# Altium schematic sheet TOP.SchDoc: Q24 VCU
size A3; Author: JChisholm; DrawnBy: JChisholm; Organization: Queen's Formula SAE; Address1: 130 Stuart St, Kingston; Address2: Ontario; Address3: Canada; Address4: K7L 2V9; DocumentNumber: 1; Revision: 0; SheetNumber: 1; SheetTotal: 16
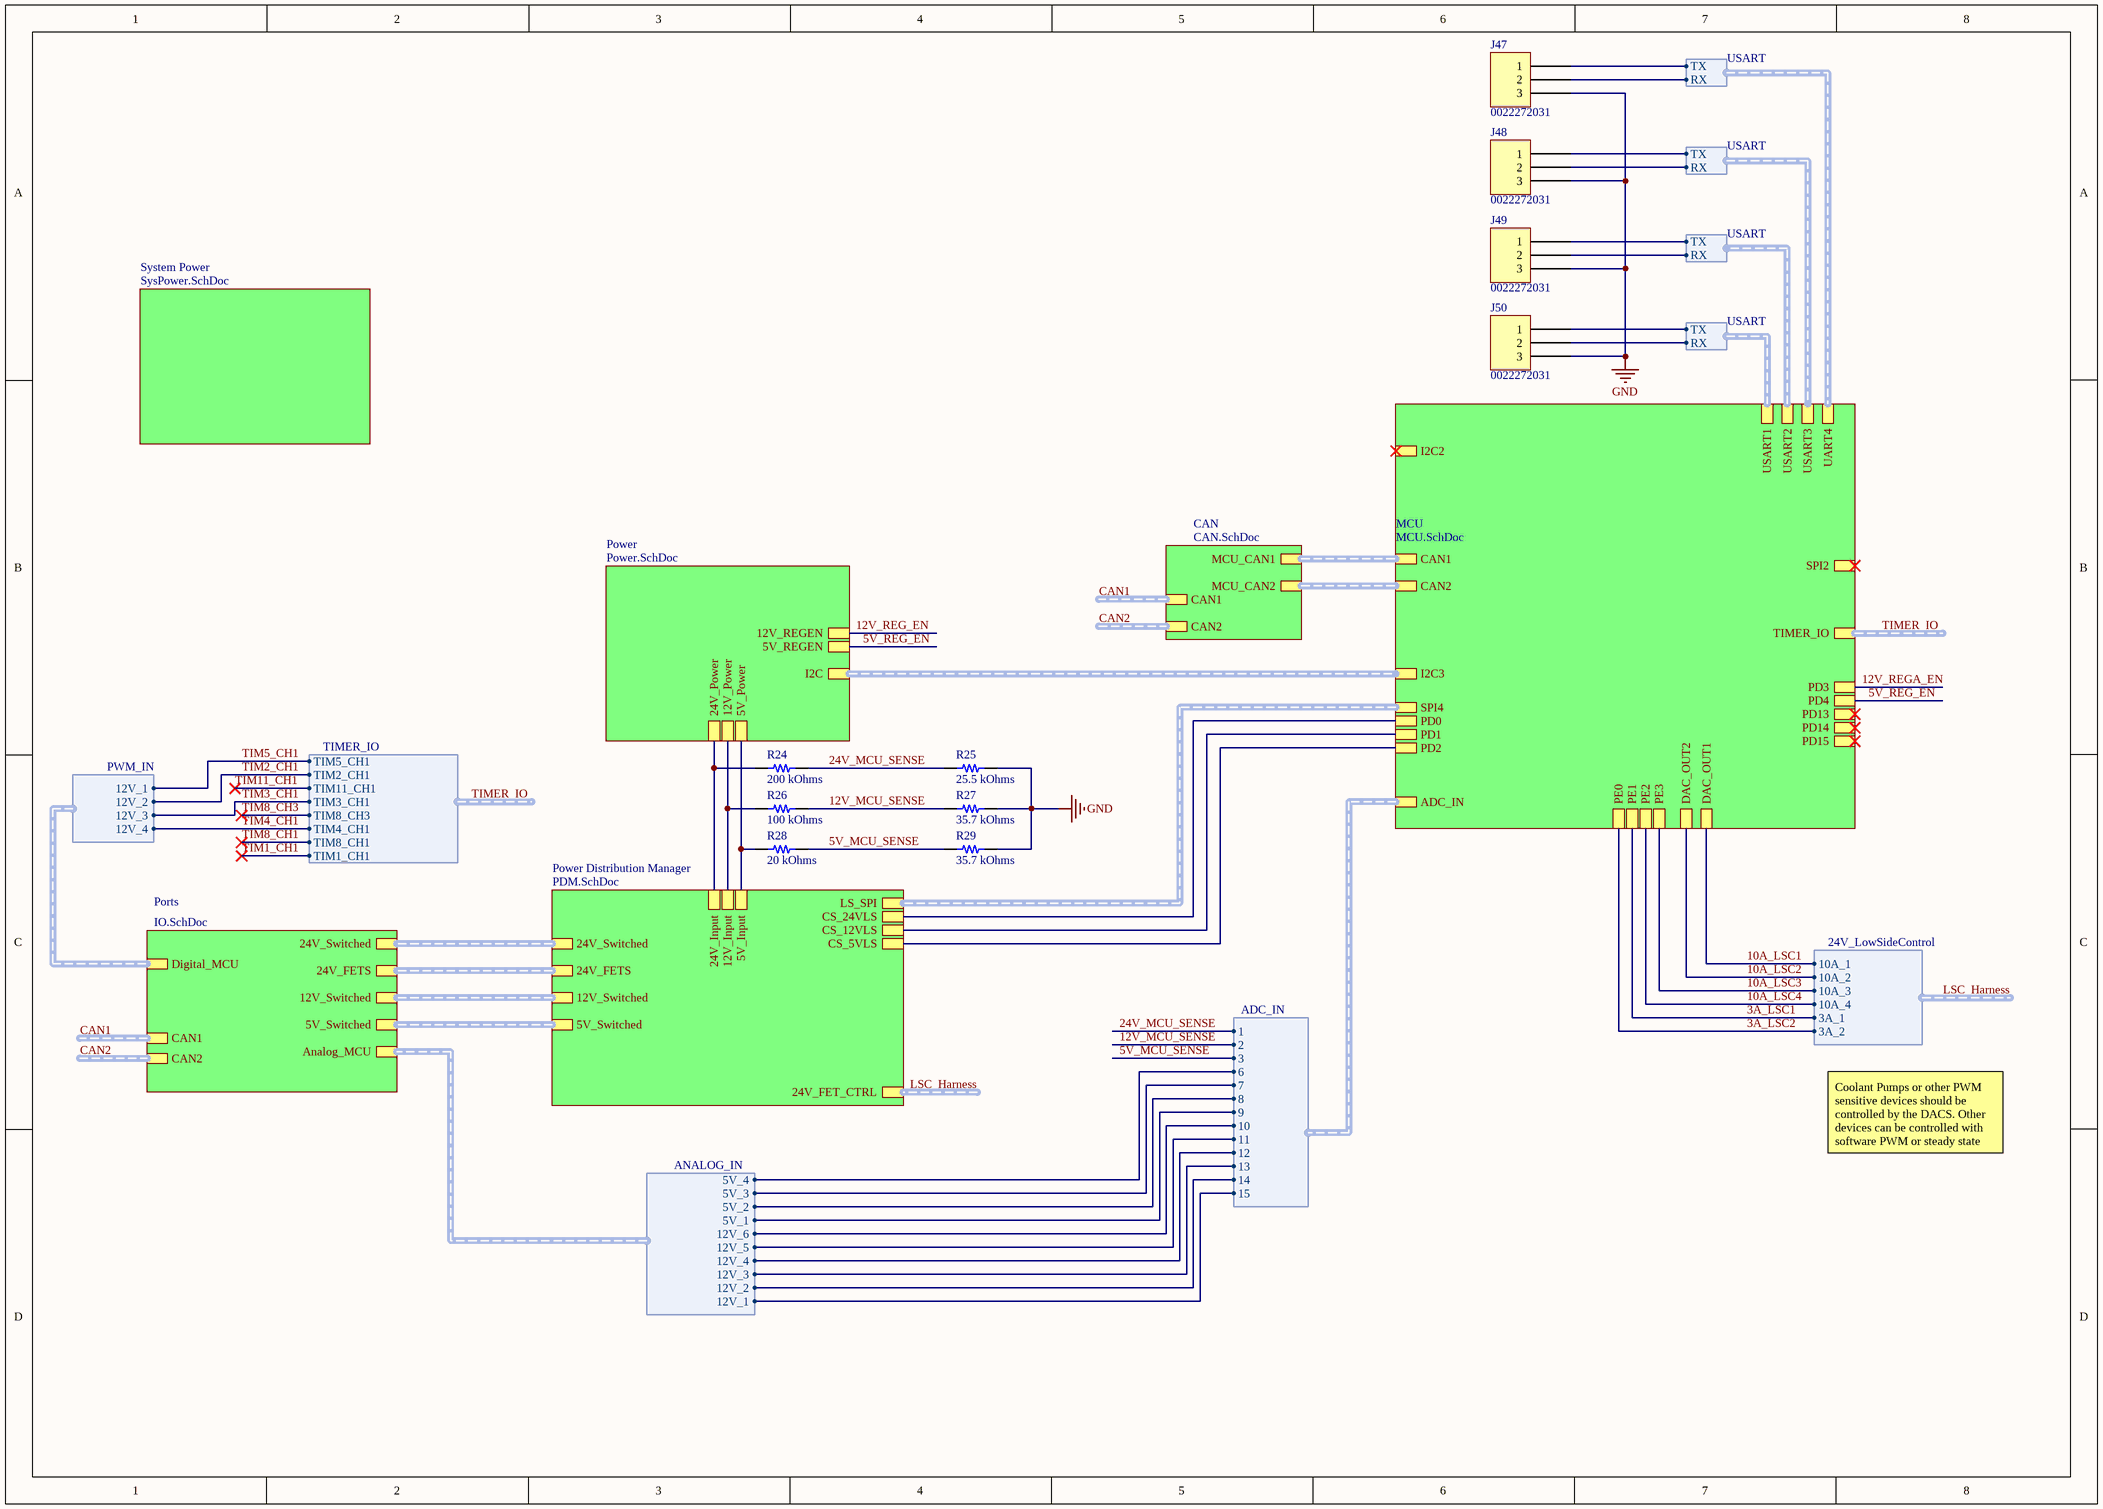
[diagram p0: TOP.SchDoc]

## Parts
J47  0022272031  [MOLEX KK 0022272031]
J48  0022272031  [MOLEX KK 0022272031]
J49  0022272031  [MOLEX KK 0022272031]
J50  0022272031  [MOLEX KK 0022272031]
R24  200 kOhms  [RES 0603_1608]
R25  25.5 kOhms  [RES 0603_1608]
R26  100 kOhms  [RES 0603_1608]
R27  35.7 kOhms  [RES 0603_1608]
R28  20 kOhms  [RES 0603_1608]
R29  35.7 kOhms  [RES 0603_1608]

## Sub-sheets
CAN = CAN.SchDoc: MCU_CAN1 (harness MCU_CAN), MCU_CAN2 (harness MCU_CAN), CAN1 (harness CAN), CAN2 (harness CAN)
MCU = MCU.SchDoc: TIMER_IO (harness TIMER_IO), PD0, PD1, PD2, PD3, PD4, ADC_IN (harness ADC_IN), UART4 (harness USART), USART2 (harness USART), SPI2 (harness SPI), USART1 (harness USART), CAN2 (harness MCU_CAN), CAN1 (harness MCU_CAN), USART3 (harness USART), SPI4 (harness SPI), I2C3 (harness I2C), DAC_OUT1, DAC_OUT2, PD13, PD14, PD15, PE0, PE1, PE2, PE3, I2C2 (harness I2C)
Ports = IO.SchDoc: CAN1 (harness CAN), CAN2 (harness CAN), 24V_Switched (harness 24V_LoadSwitches), 12V_Switched (harness 12V_LoadSwitches), 5V_Switched (harness 5V_LoadSwitches), 24V_FETS (harness 24V_FETS), Analog_MCU (harness ANALOG_IN), Digital_MCU (harness PWM_IN)
Power = Power.SchDoc: I2C (harness I2C), 12V_REGEN, 5V_REGEN, 24V_Power, 12V_Power, 5V_Power
Power Distribution Manager = PDM.SchDoc: 24V_Switched (harness 24V_LoadSwitches), 12V_Switched (harness 12V_LoadSwitches), 5V_Switched (harness 5V_LoadSwitches), 24V_FETS (harness 24V_FETS), 24V_FET_CTRL (harness 24V_LowSideControl), CS_24VLS, CS_12VLS, CS_5VLS, LS_SPI (harness SPI), 24V_Input, 12V_Input, 5V_Input
System Power = SysPower.SchDoc: no entries

## Harnesses
TIMER_IO: TIM5_CH1, TIM2_CH1, TIM11_CH1, TIM3_CH1, TIM8_CH3, TIM4_CH1, TIM8_CH1, TIM1_CH1
ANALOG_IN: 12V_1, 12V_2, 12V_3, 12V_4, 12V_5, 12V_6, 5V_1, 5V_2, 5V_3, 5V_4
ADC_IN: 1, 2, 3, 8, 9, 10, 11, 12, 13, 14, 15, 6, 7
24V_LowSideControl: 10A_1, 10A_2, 10A_3, 10A_4, 3A_1, 3A_2
PWM_IN: 12V_1, 12V_2, 12V_3, 12V_4
USART: TX, RX

## Nets
GND: J47.3 J48.3 J49.3 J50.3 R25.2 R27.2 R29.2
3A_LSC1: sheet MCU/PE1, sheet Power Distribution Manager/24V_FET_CTRL.3A_1
3A_LSC2: sheet MCU/PE0, sheet Power Distribution Manager/24V_FET_CTRL.3A_2
5V_MCU_SENSE: R28.2 R29.1 ; sheet MCU/ADC_IN.3
5V_REG_EN: sheet MCU/PD4, sheet Power/5V_REGEN
10A_LSC1: sheet MCU/DAC_OUT1, sheet Power Distribution Manager/24V_FET_CTRL.10A_1
10A_LSC2: sheet MCU/DAC_OUT2, sheet Power Distribution Manager/24V_FET_CTRL.10A_2
10A_LSC3: sheet MCU/PE3, sheet Power Distribution Manager/24V_FET_CTRL.10A_3
10A_LSC4: sheet MCU/PE2, sheet Power Distribution Manager/24V_FET_CTRL.10A_4
12V_MCU_SENSE: R26.2 R27.1 ; sheet MCU/ADC_IN.2
12V_REG_EN: sheet Power/12V_REGEN
12V_REGA_EN: sheet MCU/PD3
24V_MCU_SENSE: R24.2 R25.1 ; sheet MCU/ADC_IN.1
TIM1_CH1: sheet MCU/TIMER_IO.TIM1_CH1
TIM2_CH1: sheet MCU/TIMER_IO.TIM2_CH1, sheet Ports/Digital_MCU.12V_2
TIM3_CH1: sheet MCU/TIMER_IO.TIM3_CH1, sheet Ports/Digital_MCU.12V_3
TIM4_CH1: sheet MCU/TIMER_IO.TIM4_CH1, sheet Ports/Digital_MCU.12V_4
TIM5_CH1: sheet MCU/TIMER_IO.TIM5_CH1, sheet Ports/Digital_MCU.12V_1
TIM8_CH1: sheet MCU/TIMER_IO.TIM8_CH1
TIM8_CH3: sheet MCU/TIMER_IO.TIM8_CH3
TIM11_CH1: sheet MCU/TIMER_IO.TIM11_CH1
NetJ47_1: J47.1 ; sheet MCU/UART4.TX
NetJ47_2: J47.2 ; sheet MCU/UART4.RX
NetJ48_1: J48.1 ; sheet MCU/USART3.TX
NetJ48_2: J48.2 ; sheet MCU/USART3.RX
NetJ49_1: J49.1 ; sheet MCU/USART2.TX
NetJ49_2: J49.2 ; sheet MCU/USART2.RX
NetJ50_1: J50.1 ; sheet MCU/USART1.TX
NetJ50_2: J50.2 ; sheet MCU/USART1.RX
NetR24_1: R24.1 ; sheet Power Distribution Manager/24V_Input, sheet Power/24V_Power
NetR26_1: R26.1 ; sheet Power Distribution Manager/12V_Input, sheet Power/12V_Power
NetR28_1: R28.1 ; sheet Power Distribution Manager/5V_Input, sheet Power/5V_Power
(unnamed): sheet MCU/PD0, sheet Power Distribution Manager/CS_24VLS
(unnamed): sheet MCU/PD1, sheet Power Distribution Manager/CS_12VLS
(unnamed): sheet MCU/PD2, sheet Power Distribution Manager/CS_5VLS
(unnamed): sheet Ports/Analog_MCU.12V_1, sheet MCU/ADC_IN.15
(unnamed): sheet Ports/Analog_MCU.12V_2, sheet MCU/ADC_IN.14
(unnamed): sheet Ports/Analog_MCU.12V_3, sheet MCU/ADC_IN.13
(unnamed): sheet Ports/Analog_MCU.12V_4, sheet MCU/ADC_IN.12
(unnamed): sheet Ports/Analog_MCU.12V_5, sheet MCU/ADC_IN.11
(unnamed): sheet Ports/Analog_MCU.12V_6, sheet MCU/ADC_IN.10
(unnamed): sheet Ports/Analog_MCU.5V_1, sheet MCU/ADC_IN.9
(unnamed): sheet Ports/Analog_MCU.5V_2, sheet MCU/ADC_IN.8
(unnamed): sheet Ports/Analog_MCU.5V_3, sheet MCU/ADC_IN.7
(unnamed): sheet Ports/Analog_MCU.5V_4, sheet MCU/ADC_IN.6

## Buses and harness runs
harness CAN1 = sheet CAN/CAN1
harness CAN1 = sheet Ports/CAN1
harness CAN2 = sheet CAN/CAN2
harness CAN2 = sheet Ports/CAN2
harness LSC_Harness = sheet Power Distribution Manager/24V_FET_CTRL
harness sheet CAN/MCU_CAN1 = sheet MCU/CAN1
harness sheet CAN/MCU_CAN2 = sheet MCU/CAN2
harness sheet MCU/I2C3 = sheet Power/I2C
harness sheet MCU/SPI4 = sheet Power Distribution Manager/LS_SPI
harness sheet Ports/5V_Switched = sheet Power Distribution Manager/5V_Switched
harness sheet Ports/12V_Switched = sheet Power Distribution Manager/12V_Switched
harness sheet Ports/24V_FETS = sheet Power Distribution Manager/24V_FETS
harness sheet Ports/24V_Switched = sheet Power Distribution Manager/24V_Switched
harness TIMER_IO = sheet MCU/TIMER_IO

## Notes on the sheet
- Coolant Pumps or other PWM sensitive devices should be controlled by the DACS. Other devices can be controlled with software PWM or steady state
- Title
- Size:
- Date:
- A4
- Number:
- Time:
- Revision:
- Sheet
- of
- File:

## Library data of the parts
J47-J50 = 0022272031: CONN HEADER VERT 3POS 2.54MM; Part Number: 0022272031
R24 = AC0603FR-07200KL: RES SMD 200K OHM 1% 1/10W 0603; Manufacturer: Yageo; Power (Watts): 0.1W, 1/10W; Temperature Coefficient: ±100ppm/°C; Part Number: AC0603FR-07200KL; Value: 200 kOhms; ComponentLink1Description: Datasheet; ComponentLink1URL: https://www.yageo.com/upload/media/product/productsearch/datasheet/rchip/PYu-AC_51_RoHS_L_7.pdf; ComponentLink2Description: DigiKey Link; ComponentLink2URL: https://www.digikey.com/en/products/detail/yageo/AC0603FR-07200KL/5895902; Composition: Thick Film; Device Package: 0603 (1608 Metric); Features: Automotive AEC-Q200, Moisture Resistant; Height - Seated (Max): 0.022" (0.55mm); LastUpdated: 12/20/2023 8:38:29 PM; Lifecycle Status: Active; Minimum Order: 1; Number of Terminations: 2; Operating Temperature: -55°C ~ 155°C; Package / Case: 0603 (1608 Metric); Packaging: CutTape; PartId: 15822; Part Status: Active; Price: 0.01; Ratings: AEC-Q200; Resistance: 200 kOhms; Series: AC; Size / Dimension: 0.063" L x 0.031" W (1.60mm x 0.80mm); Supplier 1: DigiKey; Supplier Part Number 1: YAG3575CT-ND; Supplier Device Package: 0603; Tolerance: ±1%
R25 = CPF0603B25K5E1: RES SMD 25.5KOHM 0.1% 1/16W 0603; Manufacturer: TE Connectivity Passive Product; Power (Watts): 0.063W, 1/16W; Temperature Coefficient: ±25ppm/°C; Part Number: CPF0603B25K5E1; Value: 25.5 kOhms; ComponentLink1Description: Datasheet; ComponentLink1URL: https://www.te.com/commerce/DocumentDelivery/DDEController?Action=srchrtrv&DocNm=1773200&DocType=DS&DocLang=English; ComponentLink2Description: DigiKey Link; ComponentLink2URL: https://www.digikey.com/en/products/detail/te-connectivity-passive-product/CPF0603B25K5E1/2382925; Composition: Thin Film; Device Package: 0603 (1608 Metric); Height - Seated (Max): 0.022" (0.55mm); LastUpdated: 12/20/2023 8:36:34 PM; Lifecycle Status: Active; Minimum Order: 1; Number of Terminations: 2; Operating Temperature: -55°C ~ 155°C; Package / Case: 0603 (1608 Metric); Packaging: TapeAndReel; PartId: 75127; Part Status: Active; Price: 0.12; Resistance: 25.5 kOhms; Series: CPF, Neohm; Size / Dimension: 0.061" L x 0.031" W (1.55mm x 0.80mm); Supplier 1: DigiKey; Supplier Part Number 1: 1712-CPF0603B25K5E1CT-ND; Supplier Device Package: 0603; Tolerance: ±0.1%
R26 = AA0603FR-07100KL: RES SMD 100K OHM 1% 1/10W 0603; Manufacturer: Yageo; Power (Watts): 0.1W, 1/10W; Temperature Coefficient: ±150ppm/°C; Part Number: AA0603FR-07100KL; Value: 100 kOhms; ComponentLink1Description: Datasheet; ComponentLink1URL: https://www.yageo.com/upload/media/product/productsearch/datasheet/rchip/PYu-AA_51_RoHS_L_3.pdf; ComponentLink2Description: DigiKey Link; ComponentLink2URL: https://www.digikey.com/en/products/detail/yageo/AA0603FR-07100KL/5888687; Composition: Thick Film; Device Package: 0603 (1608 Metric); Features: Anti-Sulfur, Automotive AEC-Q200, Moisture Resistant; Height - Seated (Max): 0.022" (0.55mm); LastUpdated: 12/20/2023 8:36:28 PM; Lifecycle Status: Active; Minimum Order: 1; Number of Terminations: 2; Operating Temperature: -55°C ~ 155°C; Package / Case: 0603 (1608 Metric); Packaging: TapeAndReel; PartId: 78895; Price: 0.01; Ratings: AEC-Q200; Resistance: 100 kOhms; Series: AA; Size / Dimension: 0.063" L x 0.031" W (1.60mm x 0.80mm); Supplier 1: DigiKey; Supplier Part Number 1: 13-AA0603FR-07100KLCT-ND; Supplier Device Package: 0603; Tolerance: ±1%
R27 R29 = RT0603BRD0735K7L: RES SMD 35.7KOHM 0.1% 1/10W 0603; Manufacturer: Yageo; Power (Watts): 0.1W, 1/10W; Temperature Coefficient: ±25ppm/°C; Part Number: RT0603BRD0735K7L; Value: 35.7 kOhms; ComponentLink1Description: Datasheet; ComponentLink1URL: https://www.yageo.com/upload/media/product/productsearch/datasheet/rchip/PYu-RT_1-to-0.01_RoHS_L_11.pdf; ComponentLink2Description: DigiKey Link; ComponentLink2URL: https://www.digikey.com/en/products/detail/yageo/RT0603BRD0735K7L/1072480; Composition: Thin Film; Device Package: 0603 (1608 Metric); Height - Seated (Max): 0.022" (0.55mm); LastUpdated: 12/20/2023 8:38:52 PM; Lifecycle Status: Active; Minimum Order: 1; Number of Terminations: 2; Operating Temperature: -55°C ~ 155°C; Package / Case: 0603 (1608 Metric); Packaging: TapeAndReel; PartId: 9286; Part Status: Active; Price: 0.03; Resistance: 35.7 kOhms; Series: RT; Size / Dimension: 0.063" L x 0.031" W (1.60mm x 0.80mm); Supplier 1: DigiKey; Supplier Part Number 1: YAG1642CT-ND; Supplier Device Package: 0603; Tolerance: ±0.1%
R28 = AC0603FR-0720KL: RES SMD 20K OHM 1% 1/10W 0603; Manufacturer: Yageo; Power (Watts): 0.1W, 1/10W; Temperature Coefficient: ±100ppm/°C; Part Number: AC0603FR-0720KL; Value: 20 kOhms; ComponentLink1Description: Datasheet; ComponentLink1URL: https://www.yageo.com/upload/media/product/productsearch/datasheet/rchip/PYu-AC_51_RoHS_L_7.pdf; ComponentLink2Description: DigiKey Link; ComponentLink2URL: https://www.digikey.com/en/products/detail/yageo/AC0603FR-0720KL/5895907; Composition: Thick Film; Device Package: 0603 (1608 Metric); Features: Automotive AEC-Q200, Moisture Resistant; Height - Seated (Max): 0.022" (0.55mm); LastUpdated: 12/20/2023 8:38:24 PM; Lifecycle Status: Active; Minimum Order: 1; Number of Terminations: 2; Operating Temperature: -55°C ~ 155°C; Package / Case: 0603 (1608 Metric); Packaging: CutTape; PartId: 17364; Part Status: Active; Price: 0.01; Ratings: AEC-Q200; Resistance: 20 kOhms; Series: AC; Size / Dimension: 0.063" L x 0.031" W (1.60mm x 0.80mm); Supplier 1: DigiKey; Supplier Part Number 1: YAG3577CT-ND; Supplier Device Package: 0603; Tolerance: ±1%